# Altium schematic sheet USB_SERIAL_QUAD.SchDoc: RFSoC AMC
size 420 x 297 mm; CmpIndex: 15; CompanyName: WUT; DrawnBy: T. Przywozki; Organization: WUT ISE; Address1: Warsaw University of Technology; Address2: Nowowiejska 15/19 00-665 Warsaw; Address3: Tomasz.Przywozki@pw.edu.pl; DocumentNumber: 34; Revision: 1; SheetNumber: 34; SheetTotal: 45; Project: RFSoC AMC; ModifiedBy: T. Przywozki; CreateDate: -; CheckedDate: -; DivGrp: ISE; Designer: T. Przywozki; ModifiedDate: -; ProjectName: ADC/DAC MEZZANINE
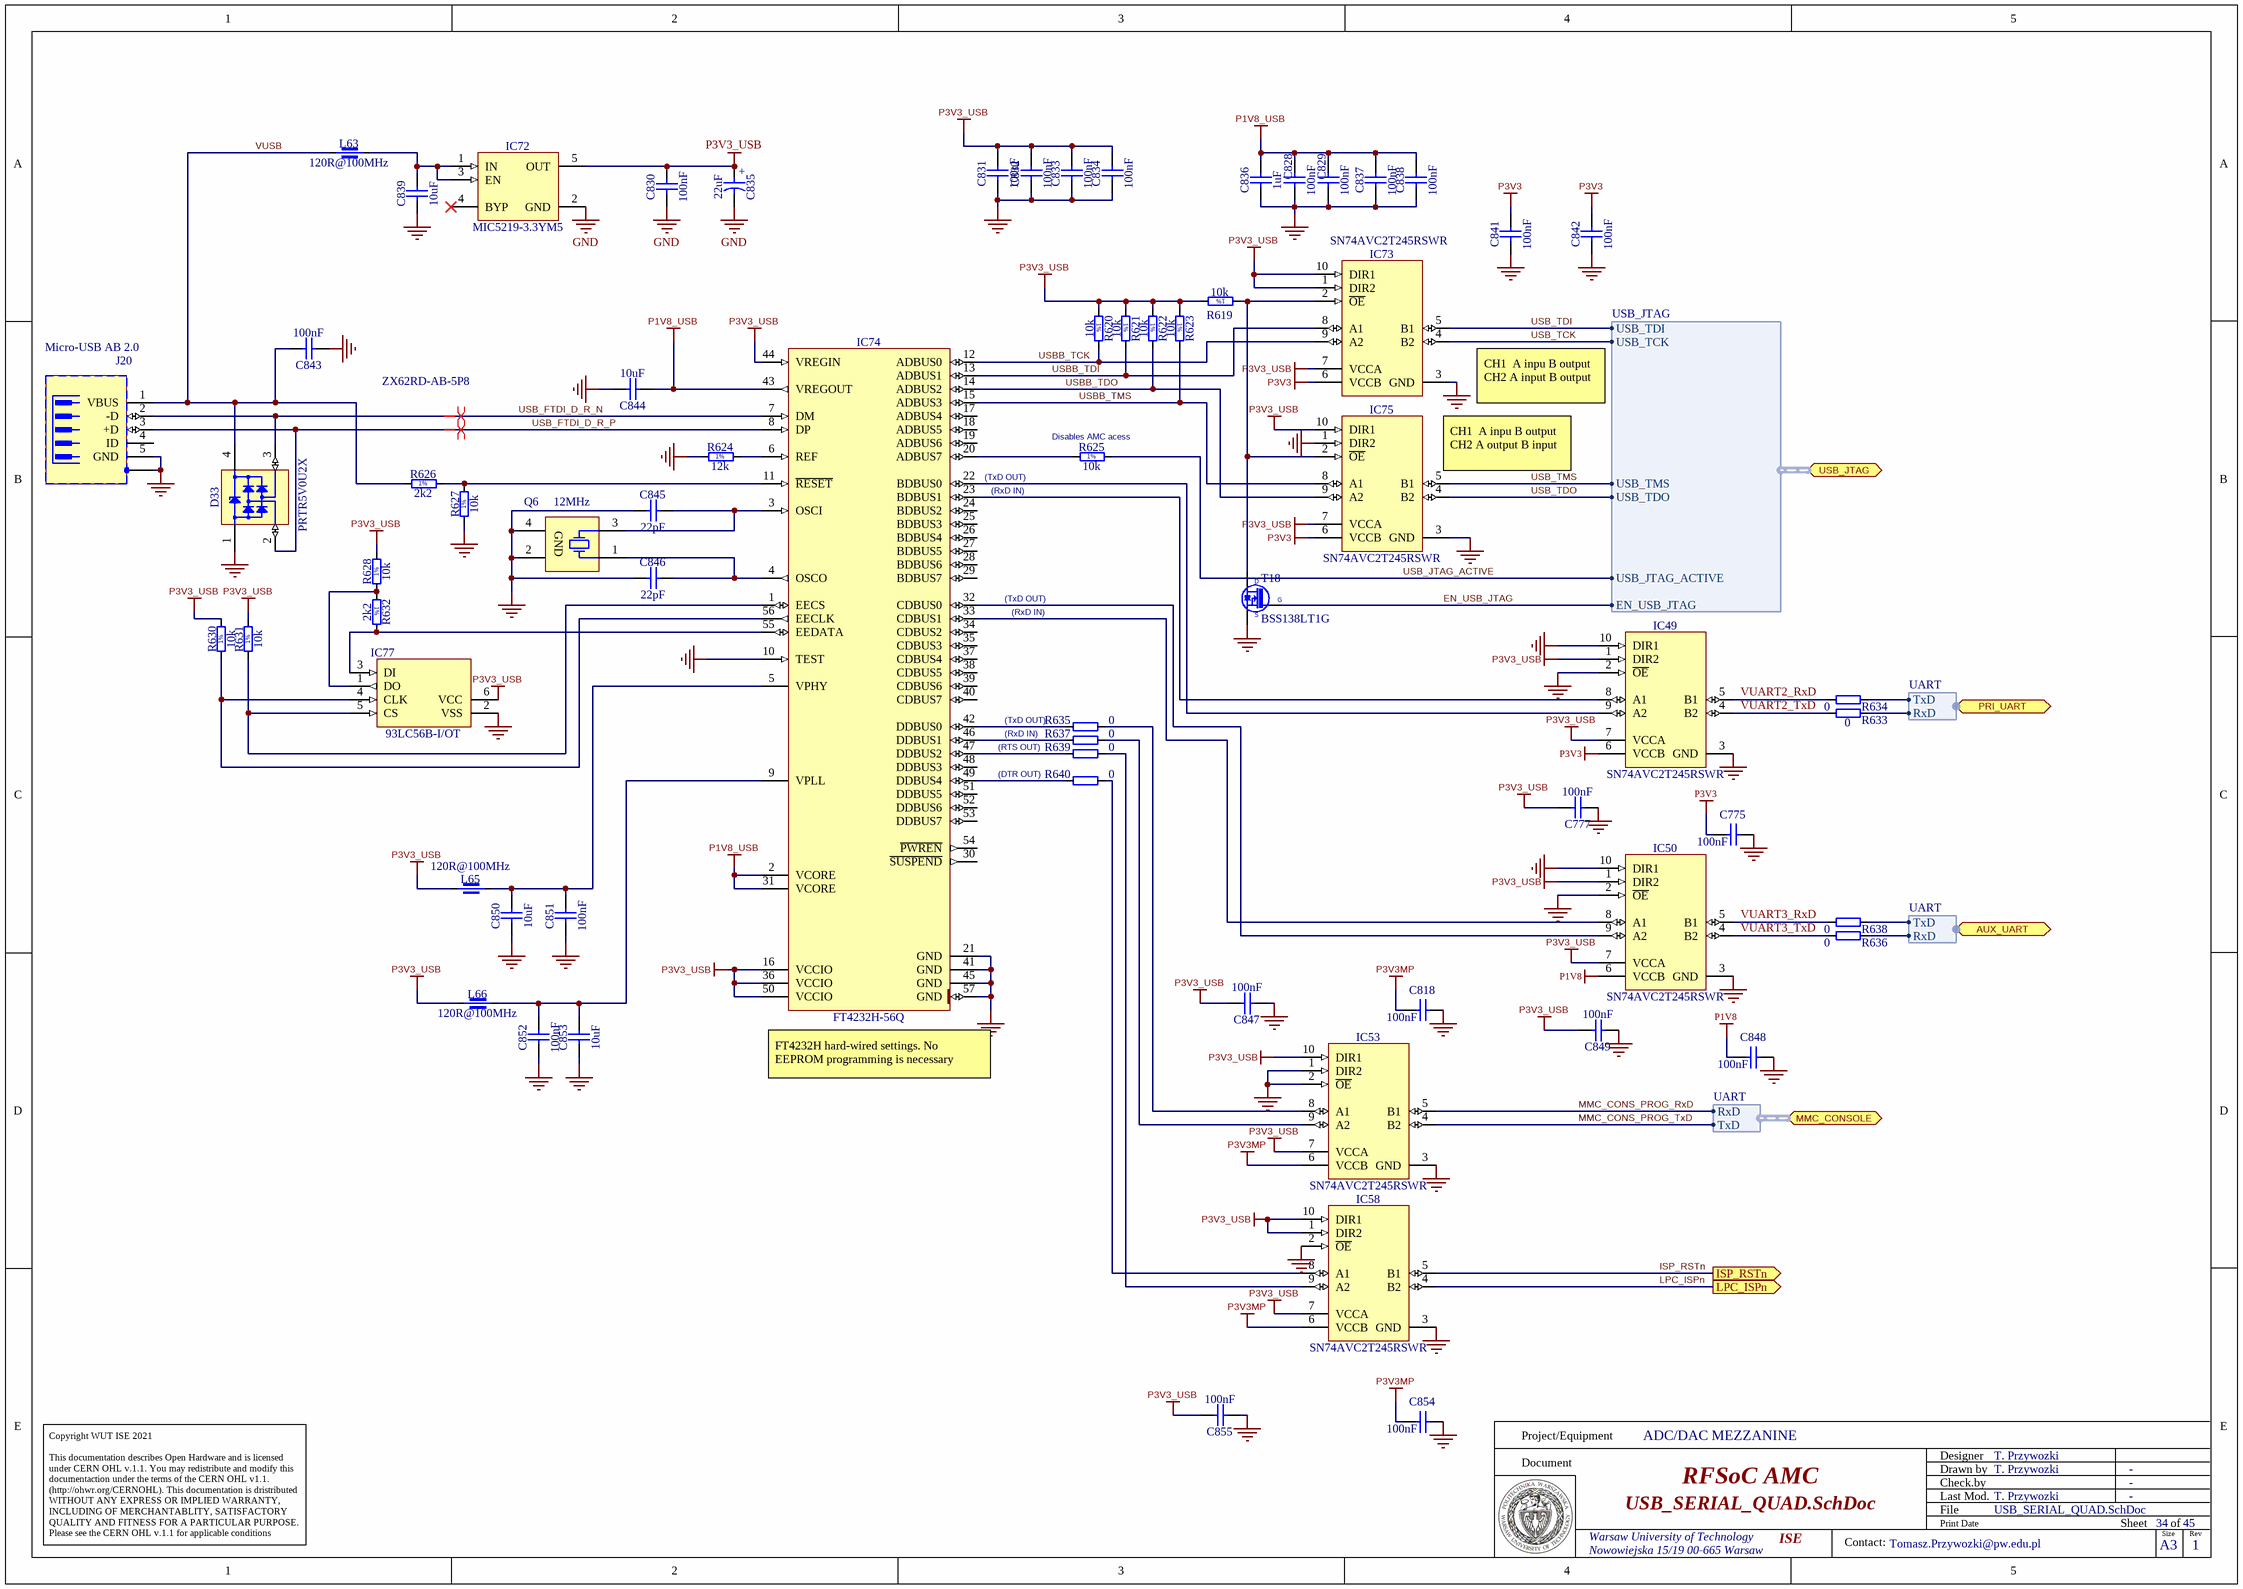
[diagram p0: USB_SERIAL_QUAD.SchDoc]

## Parts
C775  100nF  [CAPC0603X33N]
C777  100nF  [CAPC0603X33N]
C818  100nF  [CAPC0603X33N]
C828  100nF  [CAPC0603X33N]
C829  100nF  [CAPC0603X33N]
C830  100nF  [CAPC0603X33N]
C831  100nF  [CAPC0603X33N]
C832  100nF  [CAPC0603X33N]
C833  100nF  [CAPC0603X33N]
C834  100nF  [CAPC0603X33N]
C835  22uF  [CAPMP3216X180N]
C836  1uF  [CAPC1005X55N]
C837  100nF  [CAPC0603X33N]
C838  100nF  [CAPC0603X33N]
C839  10uF  [CAPC1608X87N]
C841  100nF  [CAPC0603X33N]
C842  100nF  [CAPC0603X33N]
C843  100nF  [CAPC0603X33N]
C844  10uF  [CAPC1608X87N]
C845  22pF  [CAPC1005X55N]
C846  22pF  [CAPC1005X55N]
C847  100nF  [CAPC0603X33N]
C848  100nF  [CAPC0603X33N]
C849  100nF  [CAPC0603X33N]
C850  10uF  [CAPC1608X87N]
C851  100nF  [CAPC0603X33N]
C852  100nF  [CAPC0603X33N]
C853  10uF  [CAPC1608X87N]
C854  100nF  [CAPC0603X33N]
C855  100nF  [CAPC0603X33N]
D33  PRTR5V0U2X  [SOT190P230X110-4N]
IC49  SN74AVC2T245RSWR  [QFN40P140X180X55-10N]
IC50  SN74AVC2T245RSWR  [QFN40P140X180X55-10N]
IC53  SN74AVC2T245RSWR  [QFN40P140X180X55-10N]
IC58  SN74AVC2T245RSWR  [QFN40P140X180X55-10N]
IC72  MIC5219-3.3YM5  [SOT95P280X145-5N]
IC73  SN74AVC2T245RSWR  [QFN40P140X180X55-10N]
IC74  FT4232H-56Q  [QFN50P800X800X100-57N-S620]
IC75  SN74AVC2T245RSWR  [QFN40P140X180X55-10N]
IC77  93LC56B-I/OT  [SOT95P270x145-6N]
J20  Micro-USB AB 2.0  Manufacturer Part Number: ZX62RD-AB-5P8  [HIROSE_ZX62RD-AB-5P8]
L63  120R@100MHz  [INDC1608X65N]
L65  120R@100MHz  [INDC1608X65N]
L66  120R@100MHz  [INDC1608X65N]
Q6  12MHz  [XTAL_TXC_7M]
R619  10k  [RESC1005X40N]
R620  10k  [RESC1005X40N]
R621  10k  [RESC1005X40N]
R622  10k  [RESC1005X40N]
R623  10k  [RESC1005X40N]
R624  12k  [RESC1005X40N]
R625  10k  [RESC1005X40N]
R626  2k2  [RESC1005X40N]
R627  10k  [RESC1005X40N]
R628  10k  [RESC1005X40N]
R630  10k  [RESC1005X40N]
R631  10k  [RESC1005X40N]
R632  2k2  [RESC1005X40N]
R633  0  [RESC1005X40N]
R634  0  [RESC1005X40N]
R635  0  [RESC1005X40N]
R636  0  [RESC1005X40N]
R637  0  [RESC1005X40N]
R638  0  [RESC1005X40N]
R639  0  [RESC1005X40N]
R640  0  [RESC1005X40N]
T18  BSS138LT1G  [SOT95P240X110-3N]

## Ports
AUX_UART (bidir, harness UART), ISP_RSTn (out), LPC_ISPn (out), MMC_CONSOLE (bidir, harness UART), PRI_UART (bidir, harness UART), USB_JTAG (bidir, harness USB_JTAG)

## Harnesses
UART: RxD, TxD
USB_JTAG: USB_TDI, USB_TCK, USB_TMS, USB_TDO, USB_JTAG_ACTIVE, EN_USB_JTAG

## Nets
GND: C775.1 C777.1 C818.1 C828.1 C829.1 C830.1 C831.1 C832.1 C833.1 C834.1 C835.2 C836.2 C837.1 C838.1 C839.1 C841.1 C842.1 C843.1 C844.2 C845.1 C846.1 C847.1 C848.1 C849.1 C850.1 C851.1 C852.1 C853.1 C854.1 C855.1 D33.1(GND) IC49.2(~{OE}) IC49.3(GND) IC49.10(DIR1) IC50.2(~{OE}) IC50.3(GND) IC50.10(DIR1) IC53.1(DIR2) IC53.2(~{OE}) IC53.3(GND) IC58.2(~{OE}) IC58.3(GND) IC72.2(GND) IC73.3(GND) IC74.10(TEST) IC74.21(GND) IC74.41(GND) IC74.45(GND) IC74.57(GND) IC75.1(DIR2) IC75.3(GND) IC77.2(VSS) J20.5(GND) J20.6(SH) Q6.2(GND) Q6.4(GND) R624.1 R627.1 T18.2(S)
P1V8: C848.2 IC50.6(VCCB)
P1V8_USB: C828.2 C829.2 C836.1 C837.2 C838.2 C844.1 IC74.2(VCORE) IC74.31(VCORE) IC74.43(VREGOUT)
P3V3: C775.2 C841.2 C842.2 IC49.6(VCCB) IC73.6(VCCB) IC75.6(VCCB)
P3V3_USB: C777.2 C830.2 C831.2 C832.2 C833.2 C834.2 C835.1 C847.2 C849.2 C855.2 IC49.1(DIR2) IC49.7(VCCA) IC50.1(DIR2) IC50.7(VCCA) IC53.7(VCCA) IC53.10(DIR1) IC58.1(DIR2) IC58.7(VCCA) IC58.10(DIR1) IC72.5(OUT) IC73.1(DIR2) IC73.7(VCCA) IC73.10(DIR1) IC74.16(VCCIO) IC74.36(VCCIO) IC74.44(VREGIN) IC74.50(VCCIO) IC75.7(VCCA) IC75.10(DIR1) IC77.6(VCC) L65.1 L66.1 R619.2 R620.1 R621.1 R622.1 R623.1 R628.2 R630.2 R631.2
P3V3MP: C818.2 C854.2 IC53.6(VCCB) IC58.6(VCCB)
EN_USB_JTAG: T18.1(G) ; port USB_JTAG.EN_USB_JTAG
ISP_RSTn: IC58.5(B1) ; port ISP_RSTn
LPC_ISPn: IC58.4(B2) ; port LPC_ISPn
MMC_CONS_PROG_RxD: IC53.5(B1) ; port MMC_CONSOLE.RxD
MMC_CONS_PROG_TxD: IC53.4(B2) ; port MMC_CONSOLE.TxD
USB_FTDI_D_R_N: D33.3(I/O2) IC74.7(DM) J20.2(-D)
USB_FTDI_D_R_P: D33.2(I/O1) IC74.8(DP) J20.3(+D)
USB_JTAG_ACTIVE: R625.2 ; port USB_JTAG.USB_JTAG_ACTIVE
USB_TCK: IC73.4(B2) ; port USB_JTAG.USB_TCK
USB_TDI: IC73.5(B1) ; port USB_JTAG.USB_TDI
USB_TDO: IC75.4(B2) ; port USB_JTAG.USB_TDO
USB_TMS: IC75.5(B1) ; port USB_JTAG.USB_TMS
USBB_TCK: IC73.9(A2) IC74.12(ADBUS0) R620.2
USBB_TDI: IC73.8(A1) IC74.13(ADBUS1) R621.2
USBB_TDO: IC74.14(ADBUS2) IC75.9(A2) R622.2
USBB_TMS: IC74.15(ADBUS3) IC75.8(A1) R623.2
VUART2_RxD: IC49.5(B1) R634.2
VUART2_TxD: IC49.4(B2) R633.2
VUART3_RxD: IC50.5(B1) R638.2
VUART3_TxD: IC50.4(B2) R636.2
VUSB: C843.2 D33.4(VCC) J20.1(VBUS) L63.1 R626.1
NetC839_2: C839.2 IC72.1(IN) IC72.3(EN) L63.2
NetC845_2: C845.2 IC74.3(OSCI) Q6.3(X)
NetC846_2: C846.2 IC74.4(OSCO) Q6.1(X)
NetC850_2: C850.2 C851.2 IC74.5(VPHY) L65.2
NetC852_2: C852.2 C853.2 IC74.9(VPLL) L66.2
NetIC49_8: IC49.8(A1) IC74.23(BDBUS1)
NetIC49_9: IC49.9(A2) IC74.22(BDBUS0)
NetIC50_8: IC50.8(A1) IC74.33(CDBUS1)
NetIC50_9: IC50.9(A2) IC74.32(CDBUS0)
NetIC53_8: IC53.8(A1) R635.2
NetIC53_9: IC53.9(A2) R637.2
NetIC58_8: IC58.8(A1) R640.2
NetIC58_9: IC58.9(A2) R639.2
NetIC73_2: IC73.2(~{OE}) IC75.2(~{OE}) R619.1 T18.3(D)
NetIC74_1: IC74.1(EECS) IC77.5(CS) R631.1
NetIC74_6: IC74.6(REF) R624.2
NetIC74_11: IC74.11(~{RESET}) R626.2 R627.2
NetIC74_20: IC74.20(ADBUS7) R625.1
NetIC74_42: IC74.42(DDBUS0) R635.1
NetIC74_46: IC74.46(DDBUS1) R637.1
NetIC74_47: IC74.47(DDBUS2) R639.1
NetIC74_49: IC74.49(DDBUS4) R640.1
NetIC74_55: IC74.55(EEDATA) IC77.3(DI) R632.2
NetIC74_56: IC74.56(EECLK) IC77.4(CLK) R630.1
NetIC77_1: IC77.1(DO) R628.1 R632.1
NetR633_1: R633.1 ; port PRI_UART.RxD
NetR634_1: R634.1 ; port PRI_UART.TxD
NetR636_1: R636.1 ; port AUX_UART.RxD
NetR638_1: R638.1 ; port AUX_UART.TxD

Not connected (* = marked no-connect by the designer): IC72 4(BYP)*; IC74 17(ADBUS4) 18(ADBUS5) 19(ADBUS6) 24(BDBUS2) 25(BDBUS3) 26(BDBUS4) 27(BDBUS5) 28(BDBUS6) 29(BDBUS7) 30(~{SUSPEND}) 34(CDBUS2) 35(CDBUS3) 37(CDBUS4) 38(CDBUS5) 39(CDBUS6) 40(CDBUS7) 48(DDBUS3) 51(DDBUS5) 52(DDBUS6) 53(DDBUS7) 54(~{PWREN}); J20 4(ID)

## Layout directives
differential pair; differential pair class 90ohm: USB_FTDI_D_R_N, USB_FTDI_D_R_P

## Notes on the sheet
- CH1  A inpu B output
  CH2 A input B output
- (near R625) Disables AMC acess
- (near IC74) (TxD OUT)
- (RxD IN)
- (near IC75) CH1  A inpu B output
  CH2 A output B input
- (TxD OUT)
- (DTR OUT)
- (RTS OUT)
- (near IC74) FT4232H hard-wired settings. No EEPROM programming is necessary
- Project/Equipment
- Document
- Designer
- Drawn by
- Check.by
- Copyright WUT ISE 2021
  This documentation describes Open Hardware and is licensed under CERN OHL v.1.1. You may redistribute and modify this documentaction under the terms of the CERN OHL v1.1.
  (http://ohwr.org/CERNOHL). This documentation is dristributed WITHOUT ANY EXPRESS OR IMPLIED WARRANTY, INCLUDING OF MERCHANTABLITY, SATISFACTORY QUALITY AND FITNESS FOR A PARTICULAR PURPOSE. Please see the CERN OHL v.1.1 for applicable conditions
- File
- Last Mod.
- Print Date
- Sheet
- Size
- A3
- of
- Rev
- Contact:
- (in symbol CTE3216-18_22UF_6.3V_10%_LESR0900) +
- (in symbol R0402_2K2_1%_0.0625W_100PPM) 1%
- (in symbol R0402_10K_1%_0.0625W_100PPM) 1%
- (in symbol R0402_12K_1%_0.0625W_100PPM) 1%

## Library data of the parts
C775 C777 C818 C828 C829 C831-C834 C837 C838 C841-C843 C847-C849 C851 C852 C854 C855 = CC0201_100NF_6.3V_10%_X5R: Non-polarised capacitor; Manufacturer: GENERIC; Part Description: SMD Multilayer Chip Ceramic Capacitor; Manufacturer1 Part Number: 02016D104KAT2A; Tolerance: ±10%; Voltage: 6.3V; TC: X5R; Manufacturer Part Number: CC0201_100NF_6.3V_10%_X5R; Part Number: CC0201_100NF_6.3V_10%_X5R; Value: 100nF; Component Kind: Standard; Component Type: Standard; Pin Count: 2; Status: Not Recommended; Case: 0201; Mounted: Yes; Socket: No; SMD: Yes; Sense: No; Manufacturer1 Example: AVX; Manufacturer1 ComponentHeight: 0.33mm; HelpURL: \\cern.ch\dfs\Applications\Altium\Datasheets\CC0201_X5R_AVX.pdf; Author: CERN DEM JLC; CreateDate: 03.12.2007; LatestRevisionDate: 03.12.2007
C830 = CC0201_100NF_6.3V_10%_X5R: Non-polarised capacitor; Part Description: SMD Multilayer Chip Ceramic Capacitor; Manufacturer: GENERIC; Manufacturer1 Part Number: 02016D104KAT2A; Voltage: 6.3V; TC: X5R; Tolerance: ±10%; Part Number: CC0201_100NF_6.3V_10%_X5R; Component Kind: Standard; Component Type: Standard; Pin Count: 2; Value: 100nF; Status: Not Recommended; Manufacturer Part Number: CC0201_100NF_6.3V_10%_X5R; Case: 0201; Mounted: Yes; Socket: No; SMD: Yes; Sense: No; Manufacturer1 Example: AVX; Manufacturer1 ComponentHeight: 0.33mm; HelpURL: \\cern.ch\dfs\Applications\Altium\Datasheets\CC0201_X5R_AVX.pdf; Author: CERN DEM JLC; CreateDate: 03.12.2007; LatestRevisionDate: 03.12.2007
C835 = CTE3216-18_22UF_6.3V_10%_LESR0900: Polarised capacitor; Manufacturer: GENERIC; Part Description: Low ESR 0R9 Solid Tantalum Chip Capacitor; Manufacturer1 Part Number: TPSA226K006R0900; Tolerance: ±10%; Voltage: 6.3V; Manufacturer Part Number: CTE3216-18_22UF_6.3V_10%_LESR0900; Part Number: CTE3216-18_22UF_6.3V_10%_LESR0900; Value: 22uF; Component Kind: Standard; Component Type: Standard; Pin Count: 2; Status: Preferred; Case: A; Mounted: Yes; Socket: No; SMD: Yes; Sense: No; Manufacturer1 Example: AVX; Manufacturer1 ComponentHeight: 1.8mm; HelpURL: \\cern.ch\dfs\Applications\Altium\Datasheets\CTE-LESR_AVX_TPS.pdf; Author: CERN DEM JLC; CreateDate: 05.05.2008; LatestRevisionDate: 20.01.2009
C836 = CC0402_1UF_16V_10%_X5R: Non-polarised capacitor; Manufacturer: GENERIC; Part Description: SMD Multilayer Chip Ceramic Capacitor; Manufacturer1 Part Number: C1005X5R1C105KT; Tolerance: ±10%; Voltage: 16V; TC: X5R; Manufacturer Part Number: CC0402_1UF_16V_10%_X5R; Part Number: CC0402_1UF_16V_10%_X5R; Value: 1uF; Component Kind: Standard; Component Type: Standard; Pin Count: 2; Status: Preferred; Case: 0402; Mounted: Yes; Socket: No; SMD: Yes; Sense: No; Manufacturer1 Example: TDK; Manufacturer1 ComponentHeight: 0.55mm; HelpURL: \\cern.ch\dfs\Applications\Altium\Datasheets\CC0402_X5R_TDK_C.pdf; Author: CERN DEM JLC; CreateDate: 25.10.2012; LatestRevisionDate: 25.10.2012
C839 C844 C850 C853 = CC0603_10UF_6.3V_20%_X5R: Non-polarised capacitor; Manufacturer: GENERIC; Part Description: SMD Multilayer Chip Ceramic Capacitor; Manufacturer1 Part Number: C0603C106M9PAC; Tolerance: ±20%; Voltage: 6.3V; TC: X5R; Manufacturer Part Number: CC0603_10uF_6.3V_20%_X5R; Part Number: CC0603_10UF_6.3V_20%_X5R; Value: 10uF; Component Kind: Standard; Component Type: Standard; Pin Count: 2; Status: Preferred; Case: 0603; Mounted: Yes; Socket: No; SMD: Yes; Sense: No; Manufacturer1 Example: KEMET; Manufacturer1 ComponentHeight: 0.95mm; HelpURL: \\cern.ch\dfs\Applications\Altium\Datasheets\CC0603_X5R_KEMET.pdf; Author: CERN DEM JLC; CreateDate: 03.12.2007; LatestRevisionDate: 03.12.2007
C845 C846 = CC0402_22PF_50V_5%_C0G: Non-polarised capacitor; Manufacturer: GENERIC; Part Description: SMD Multilayer Chip Ceramic Capacitor; Manufacturer1 Part Number: C0402C220J5GACTU; Tolerance: ±5%; Voltage: 50V; TC: C0G/NP0; Manufacturer Part Number: CC0402_22PF_50V_5%_C0G; Part Number: CC0402_22PF_50V_5%_C0G; Value: 22pF; Component Kind: Standard; Component Type: Standard; Pin Count: 2; Status: Preferred; Case: 0402; Mounted: Yes; Socket: No; SMD: Yes; Sense: No; Manufacturer1 Example: KEMET; Manufacturer1 ComponentHeight: 0.55mm; HelpURL: \\cern.ch\dfs\Applications\Altium\Datasheets\CC0805_C0G_KEMET_(Commercial Grade).pdf; Author: CERN DEM JLC; CreateDate: 03.12.2007; LatestRevisionDate: 03.12.2007
D33 = PRTR5V0U2X: Ultra Low Capacitance Double Rail-to-Rail ESD Protection Diode; Manufacturer: NXP SEMICONDUCTORS; Part Description: Ultra Low Capacitance (1pF) Double Rail-to-Rail ESD Protection Diode (8kV); Voltage: 5.5V; PressFit: No; Bonding: No; Manufacturer Part Number: PRTR5V0U2X; PackageDescription: SOT143B, SOT, 1.90mm Pitch; 4 Pin, 1.30mm W X 2.90mm L X 1.10mm H body, IPC Medium Density; Part Number: PRTR5V0U2X; Component Kind: Standard; Component Type: Standard; Device: PRTR5V0U2X; Pin Count: 4; Case: SOT143B; Mounted: Yes; Socket: No; SMD: Yes; Sense: No; ComponentHeight: 1.1mm; HelpURL: \\cern.ch\dfs\Applications\Altium\Datasheets\PRTR5V0U2X.pdf; Author: CERN DEM JLC; CreateDate: 22.03.2011; LatestRevisionDate: 22.03.2011
IC49 IC50 IC53 IC58 IC73 IC75 = SN74AVC2T245RSWR: Dual-Bit Dual-Supply Bus Transceiver With Configurable Voltage Translation and 3-State Outputs; Manufacturer: TEXAS INSTRUMENTS; PressFit: No; Bonding: No; Manufacturer Part Number: SN74AVC2T245RSWR; PackageDescription: QFN, 0.40mm Pitch, Rect.;10 Pin, 1.80mm L X 1.40mm W X 0.55mm H Body, IPC Medium Density; Part Description: Dual-Bit Dual-Supply Bus Transceiver With Configurable Voltage Translation and 3-State Outputs; Part Number: SN74AVC2T245RSWR; Component Kind: Standard; Component Type: Standard; Device: SN74AVC2T245RSWR; Status: Not Recommended; Pin Count: 10; Case: QFN10; Mounted: Yes; Socket: No; SMD: Yes; Sense: No; ComponentHeight: 0.55mm; Author: CERN DEM JLC; HelpURL: \\cern.ch\dfs\Applications\Altium\Datasheets\SN74AVC2T245RSWR.pdf; CreateDate: 07.07.2014; LatestRevisionDate: 30.03.2017
IC72 = MIC5219-3.3YM5: 500mA Peak Output LDO Regulator; Part Description: 3.3V 500mA Peak Output Low Drop-Out  (LDO) Regulator; Manufacturer: MICROCHIP TECHNOLOGY; PressFit: No; Bonding: No; Part Number: MIC5219-3.3YM5; Component Kind: Standard; Component Type: Standard; Device: MIC5219-3.3YM5; PackageDescription: SOT, 0.95mm pitch; 5 pin, 1.60mm W X 2.90mm L X 1.45mm H body, IPC Medium Density; Manufacturer Part Number: MIC5219-3.3YM5; Pin Count: 5; Case: SOT23-5; Mounted: Yes; Socket: No; SMD: Yes; Sense: No; ComponentHeight: 1.45mm; HelpURL: \\cern.ch\dfs\Applications\Altium\Datasheets\MIC5219-3.3YM5.pdf; Author: CERN DEM WB; CreateDate: 2019-04-16; LatestRevisionDate: 2019-04-16
IC74 = FT4232H-56Q: Quad High Speed USB to Multipurpose UART/MPSSE IC; Manufacturer: FUTURE TECHNOLOGY DEVICES INTERNATIONAL (FTDI); PressFit: No; Bonding: No; Manufacturer Part Number: FT4232H-56Q; PackageDescription: QFN, 0.50mm Pitch, Square; 56 Pin, 8.00mm L X 8.00mm W X 1.00mm H body (6.1mm X 6.1mm Thermal tab), IPC Medium Density; Part Description: Quad High Speed USB to Multipurpose UART/MPSSE IC; Part Number: FT4232H-56Q; Component Kind: Standard; Component Type: Standard; Device: FT4232H-56Q; Pin Count: 57; Case: QFN56; Mounted: Yes; Socket: No; SMD: Yes; Sense: No; ComponentHeight: 1mm; Author: CERN DEM JLC; HelpURL: \\cern.ch\dfs\Applications\Altium\Datasheets\FT4232H-56Q.pdf; CreateDate: 11.10.2016; LatestRevisionDate: 11.10.2016
IC77 = 93LC56B-I/OT: 2K Microwire Compatible Serial EEPROM; Part Description: 2K, 128X16-bit, 2.5V Microwire Compatible Serial EEPROM; Manufacturer: MICROCHIP TECHNOLOGY; PressFit: No; Bonding: No; Part Number: 93LC56B-I/OT; Component Kind: Standard; Component Type: Standard; Device: 93LC56B-I/OT; Footprint: SOT95P270X145-6N; PackageDescription: SOT, 0.95mm Pitch; 6 Pin,1.55mm W X 2.90mm L X 1.45mm H body, IPC Medium Density; Manufacturer Part Number: 93LC56B-I/OT; Pin Count: 6; Case: SOT23-6; Mounted: Yes; Socket: No; SMD: Yes; Sense: No; ComponentHeight: 1.45mm; HelpURL: \\cern.ch\dfs\Applications\Altium\Datasheets\93LC56B-IOT.pdf; Author: CERN DEM BC; CreateDate: 06.04.2018; LatestRevisionDate: 06.04.2018
J20 = HIROSE_ZX62RD-AB-5P8: 5 Pin + 1 Shield USB Receptacle; Manufacturer: HIROSE (HRS); Part Description: Micro-USB 2.0 Right Angle, SMD Type AB - Reverse (Top mount), Shell Through Hole; PressFit: No; Part Number: HIROSE_ZX62RD-AB-5P8; Component Kind: Standard; Component Type: Standard; Pin Count: 7; Family: Micro-USB AB 2.0; Mounted: Yes; Socket: No; SMD: Yes; Sense: No; Status: Obsolete; ComponentHeight: 2.35mm; HelpURL: \\cern.ch\dfs\Applications\Altium\Datasheets\HIROSE_ZX62RD-AB-5P8.pdf; ComponentLink1URL: \\cern.ch\dfs\Applications\Altium\Datasheets\HIROSE_ZX62RD-AB-5P8_Package-Drawing.pdf; ComponentLink1Description: Package-Drawing; Author: CERN DEM JLC; CreateDate: 29.10.2014; LatestRevisionDate: 22.06.2017
L63 L65 L66 = IND0603_MURATA_BLM18SG121TN1D: Manufacturer: MURATA; Part Description: SMD EMIFIL Suppression Chip Ferrite Bead; Tolerance: ±25%; Power: 3A; Resistance: 0.025R; Manufacturer Part Number: BLM18SG121TN1D; Part Number: IND0603_MURATA_BLM18SG121TN1D; Value: 120R@100MHz; Component Kind: Standard; Component Type: Standard; Pin Count: 2; Status: None; Case: 0603; Mounted: Yes; Socket: No; SMD: Yes; Sense: No; ComponentHeight: 0.65mm; HelpURL: \\cern.ch\dfs\Applications\Altium\Datasheets\IND0603_MURATA_BLM18S.pdf; Author: CERN DEM JLC; CreateDate: 23.07.2014; LatestRevisionDate: 25.10.2018
Q6 = XTAL_12MHZ_TXC_7M-12.000MAAJ-T: Crystal 4 pins 1=XTAL Control 2=GND3=XTAL 4=GND; Manufacturer: TXC CORPORATION; Part Description: ±30ppm 18pF -20°C to +70°C  4 Pins, 3.2x2.5X0.8mm, SMD Sealing Crystal, 7M Series; PressFit: No; Bonding: No; Manufacturer Part Number: 7M-12.000MAAJ-T; PackageDescription: 4 Pins, 2.5x3.2mm, SMD Sealing Crystal, 7M Serie; Part Number: XTAL_12MHZ_TXC_7M-12.000MAAJ-T; Value: 12MHz; Component Kind: Standard; Component Type: Standard; Pin Count: 4; Mounted: Yes; Socket: No; SMD: Yes; Sense: No; ComponentHeight: 0.8mm; HelpURL: \\cern.ch\dfs\Applications\Altium\Datasheets\XTAL_TXC_7M.pdf; Author: CERN DEM JLC; CreateDate: 19.06.2012; LatestRevisionDate: 19.06.2012
R619-R623 R625 R627 R628 R630 R631 = R0402_10K_1%_0.0625W_100PPM: Resistor - 1%; Manufacturer: GENERIC; Part Description: General Purpose Thick Film Chip Resistor; Manufacturer1 Part Number: 232270671003L; TC: ±100ppm/°C; PressFit: No; Manufacturer Part Number: R0402_10K_1%_0.0625W_100PPM; Part Number: R0402_10K_1%_0.0625W_100PPM; Tolerance: ±1%; Value: 10k; Component Kind: Standard; Component Type: Standard; Pin Count: 2; Status: Not Recommended; Power: 0.0625W; Case: 0402; Mounted: Yes; Sense: No; Socket: No; SMD: Yes; Manufacturer1 Example: YAGEO PHYCOMP; Manufacturer1 ComponentHeight: 0.4mm; HelpURL: \\cern.ch\dfs\Applications\Altium\Datasheets\R0402_Phycomp_RC0402.pdf; Author: CERN DEM JLC; CreateDate: 03.12.2007; LatestRevisionDate: 17.10.2012
R624 = R0402_12K_1%_0.0625W_100PPM: Resistor - 1%; Manufacturer: GENERIC; Part Description: General Purpose Thick Film Chip Resistor; Manufacturer1 Part Number: 232270671203L; TC: ±100ppm/°C; PressFit: No; Manufacturer Part Number: R0402_12K_1%_0.0625W_100PPM; Part Number: R0402_12K_1%_0.0625W_100PPM; Tolerance: ±1%; Value: 12k; Component Kind: Standard; Component Type: Standard; Pin Count: 2; Status: Not Recommended; Power: 0.0625W; Case: 0402; Mounted: Yes; Sense: No; Socket: No; SMD: Yes; Manufacturer1 Example: YAGEO PHYCOMP; Manufacturer1 ComponentHeight: 0.4mm; HelpURL: \\cern.ch\dfs\Applications\Altium\Datasheets\R0402_Phycomp_RC0402.pdf; Author: CERN DEM JLC; CreateDate: 03.12.2007; LatestRevisionDate: 17.10.2012
R626 R632 = R0402_2K2_1%_0.0625W_100PPM: Resistor - 1%; Manufacturer: GENERIC; Part Description: General Purpose Thick Film Chip Resistor; Manufacturer1 Part Number: 232270672202L; TC: ±100ppm/°C; PressFit: No; Manufacturer Part Number: R0402_2K2_1%_0.0625W_100PPM; Part Number: R0402_2K2_1%_0.0625W_100PPM; Tolerance: ±1%; Value: 2k2; Component Kind: Standard; Component Type: Standard; Pin Count: 2; Status: Not Recommended; Power: 0.0625W; Case: 0402; Mounted: Yes; Sense: No; Socket: No; SMD: Yes; Manufacturer1 Example: YAGEO PHYCOMP; Manufacturer1 ComponentHeight: 0.4mm; HelpURL: \\cern.ch\dfs\Applications\Altium\Datasheets\R0402_Phycomp_RC0402.pdf; Author: CERN DEM JLC; CreateDate: 03.12.2007; LatestRevisionDate: 17.10.2012
R633-R640 = R0402_0R_JUMPER: Resistor; Manufacturer: GENERIC; Part Description: 1A (0.05R Max DC Resistance) Zero Ohm Jumper; Manufacturer1 Part Number: 232270591001L; PressFit: No; Manufacturer Part Number: R0402_0R_JUMPER; Part Number: R0402_0R_JUMPER; Value: 0; Component Kind: Standard; Component Type: Standard; Pin Count: 2; Status: Not Recommended; Case: 0402; Mounted: Yes; Sense: No; Socket: No; SMD: Yes; Manufacturer1 Example: YAGEO PHYCOMP; Manufacturer1 ComponentHeight: 0.4mm; HelpURL: \\cern.ch\dfs\Applications\Altium\Datasheets\R0402_Phycomp_RC0402.pdf; Author: CERN DEM JLC; CreateDate: 03.12.2007; LatestRevisionDate: 17.10.2012
T18 = BSS138LT1G: N-CHANNEL MOSFET WITH DIODE; Manufacturer: ON SEMICONDUCTOR; Part Description: 50V 200mA N-Channel Enhancement Mode Field-Effect Transistor; PressFit: No; Bonding: No; Manufacturer Part Number: BSS138LT1G; PackageDescription: SOT23 3-Leads, Pitch 0.95mm - Body 1.4x3mm, IPC Medium Density; Part Number: BSS138LT1G; Component Kind: Standard; Component Type: Standard; Device: BSS138LT1G; Pin Count: 3; Case: SOT23-3; Mounted: Yes; Socket: No; SMD: Yes; Sense: No; ComponentHeight: 1.11mm; HelpURL: \\cern.ch\dfs\Applications\Altium\Datasheets\BSS138LT1G.pdf; Author: CERN DEM JLC; CreateDate: 23.03.2009; LatestRevisionDate: 23.03.2009